# EAGLE board PT08ttl3 (EAGLE 6.6.0)
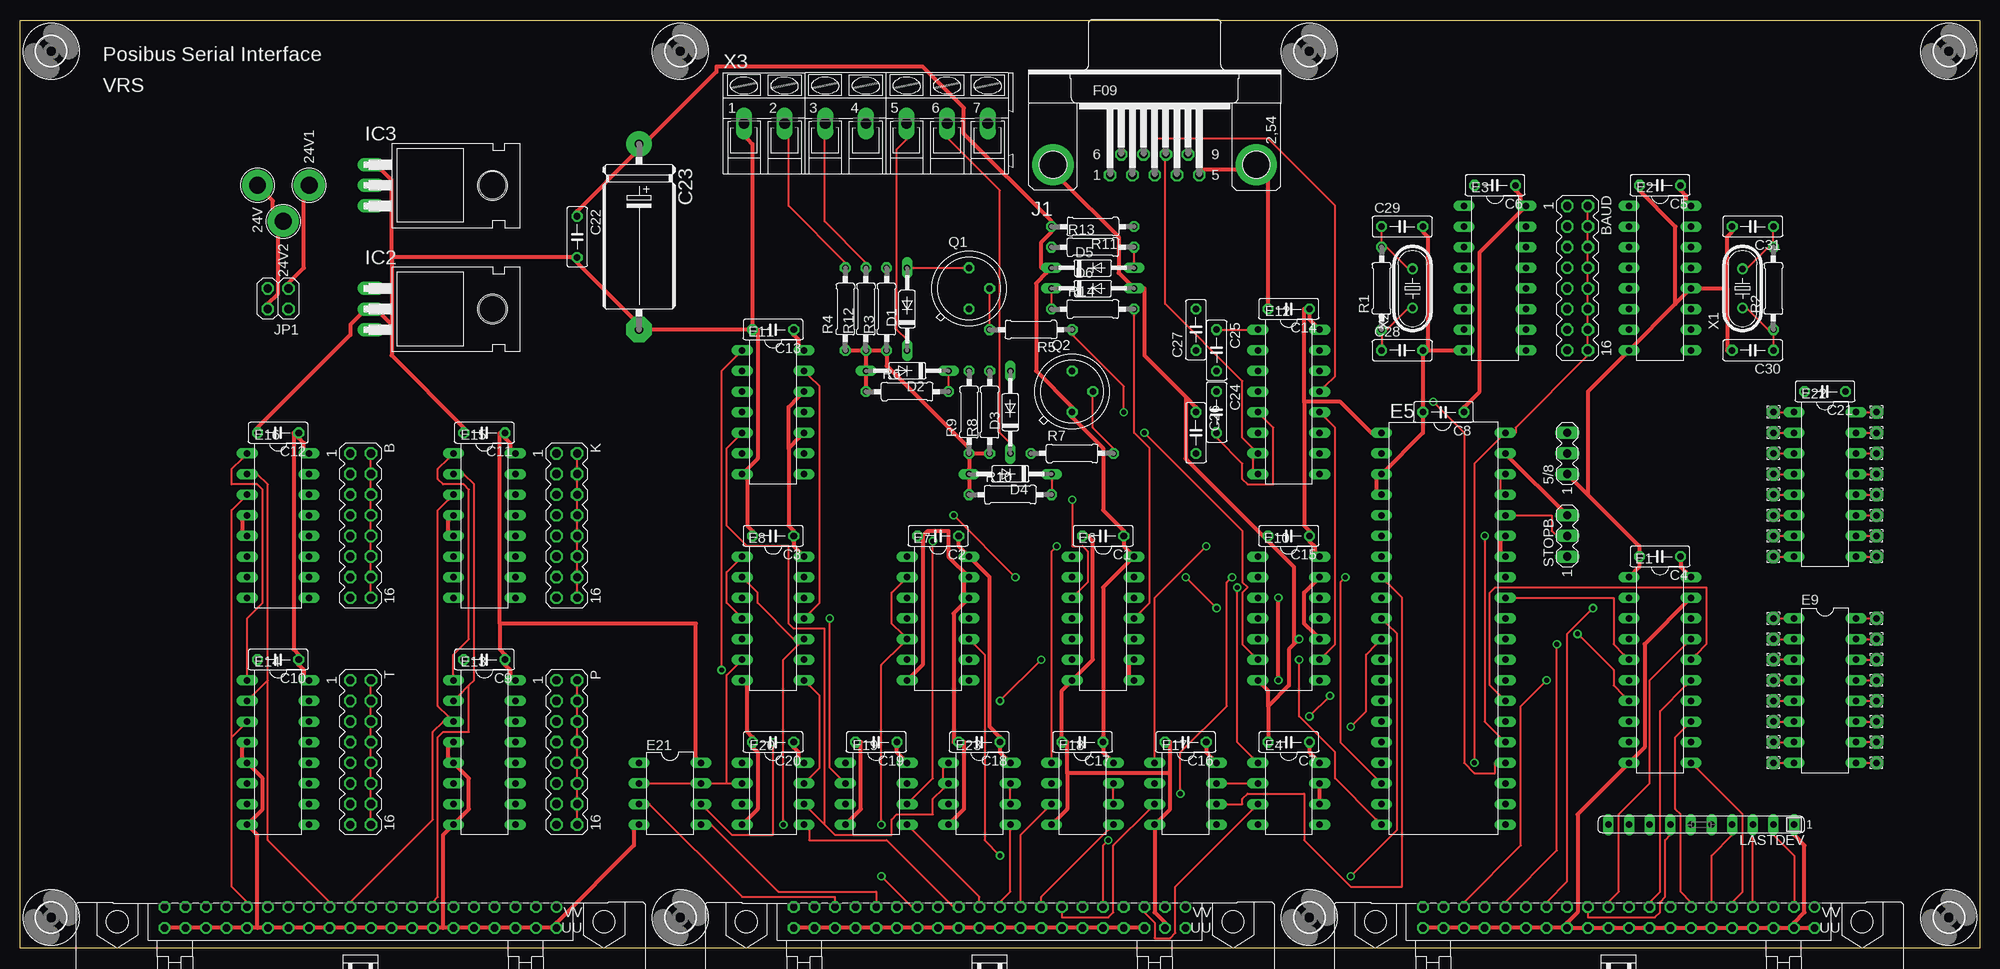
[diagram p2: board, top side]
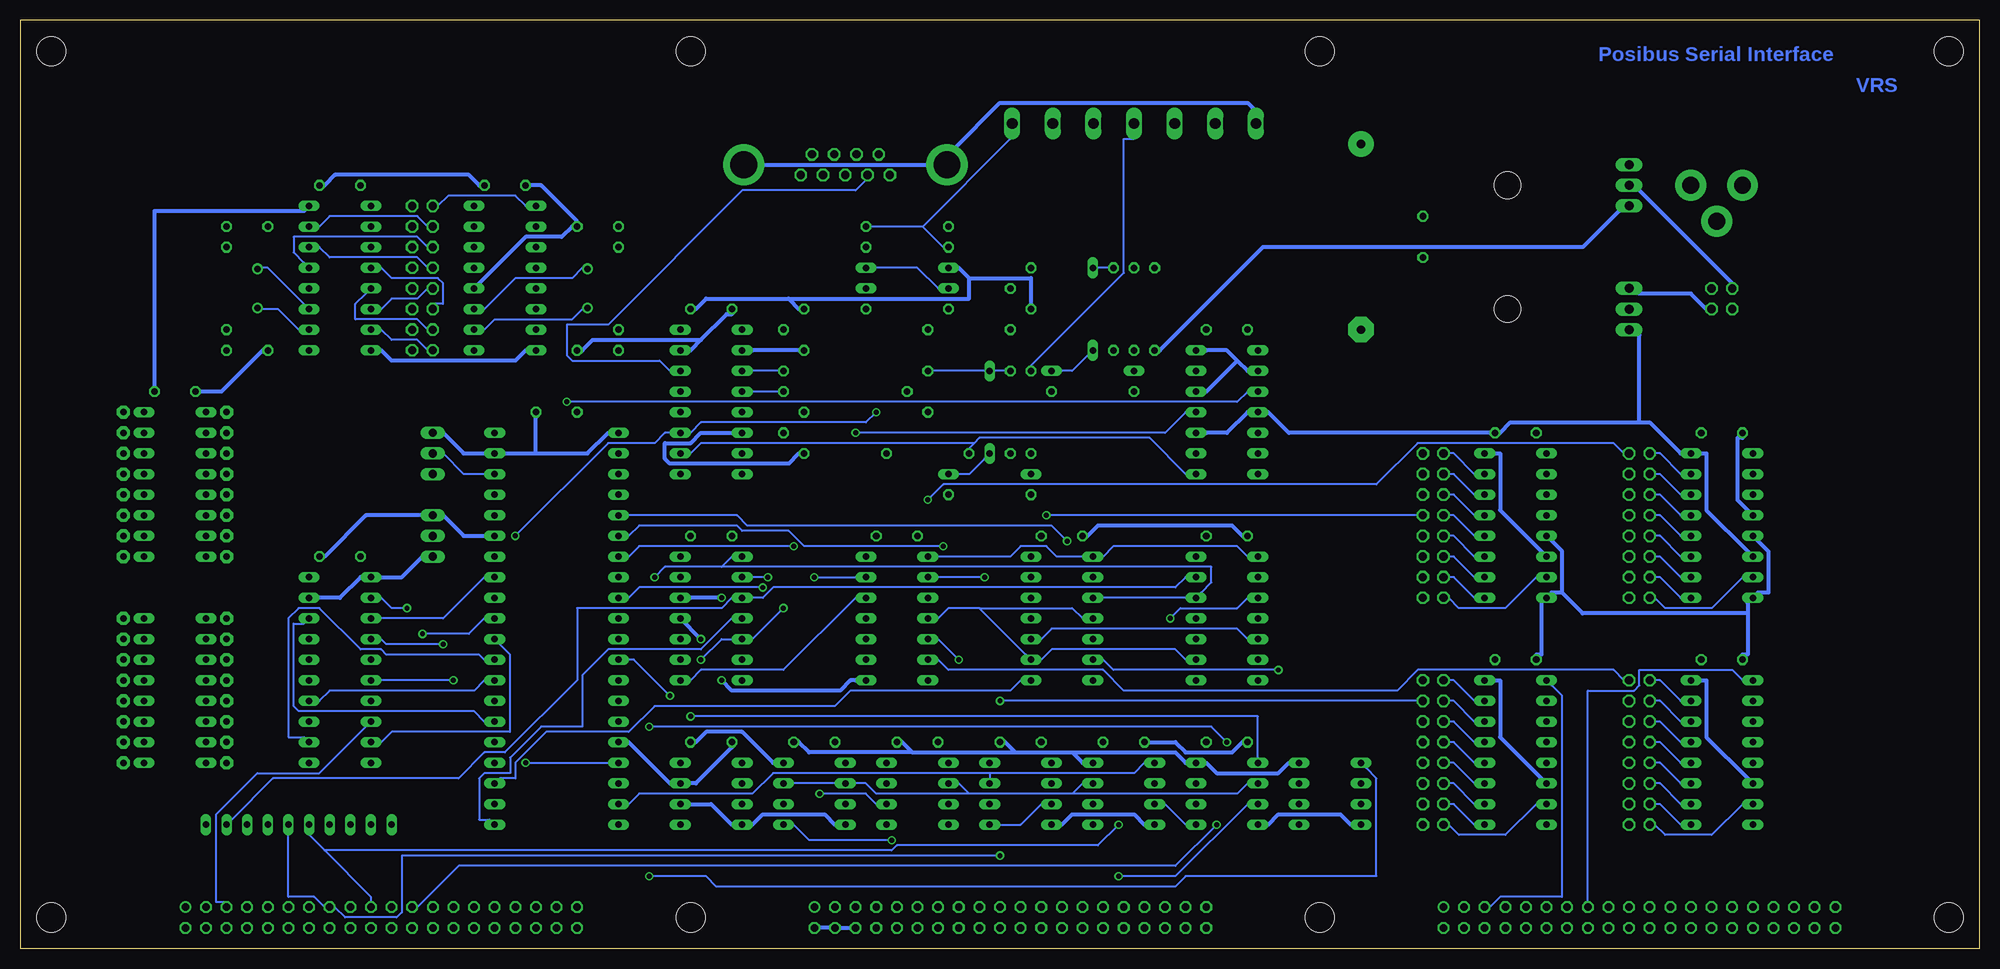
[diagram p3: board, bottom side, seen from below]

Size 241.3 x 114.3 mm. Coordinates in mm from the lower left corner, seen from the top.
Outline: 0,0 0,114.3 241.3,114.3 241.3,0 0,0
Copper layers (1*16): Top 0.035mm / dielectric 1.5mm / Bottom 0.035mm
Design rules "olimex10mil": minimum track width 10mil, minimum drill 24mil, track to track 10mil, track to pad 10mil, pad to pad 10mil, via to via 10mil, smd to smd 10mil, copper to edge 25mil, drill to drill 10mil, minimum pad ring 10mil, minimum via ring 8mil, stop-mask expansion 0mil, vias tented up to drill 0mil, thermal gap 10mil
Net classes: 1 supply: width 0.508 mm

## Footprints (pad centres in the part's own frame; a part is rotated, then mirrored left to right if it is on the bottom)
MA03-1 = drill 1.016 long: 1 -2.54,0; 2 0,0; 3 2.54,0
0820 = drill 2.083 pad 3.81: P$1 0,0
MA08-2 = drill 1.016 octagon: 1 -8.89,-1.27; 2 -8.89,1.27; 3 -6.35,-1.27; 4 -6.35,1.27; 5 -3.81,-1.27; 6 -3.81,1.27; 7 -1.27,-1.27; 8 -1.27,1.27; 9 1.27,-1.27; 10 1.27,1.27; 11 3.81,-1.27; 12 3.81,1.27; 13 6.35,-1.27; 14 6.35,1.27; 15 8.89,-1.27; 16 8.89,1.27
C050-025X075 = drill 0.813 octagon: 1 -2.54,0; 2 2.54,0
E22-9 = drill 1.016 pad 3.15: + -11.43,0 | drill 1.016 pad 3.15 octagon: - 11.43,0
DO35-10 = drill 0.813 long: A 5.08,0; C -5.08,0
DEC40PINH = drill 0.914 octagon: A 24.13,1.27; AA -3.81,1.27; B 24.13,-1.27; BB -3.81,-1.27; C 21.59,1.27; CC -6.35,1.27; D 21.59,-1.27; DD -6.35,-1.27; E 19.05,1.27; EE -8.89,1.27; F 19.05,-1.27; FF -8.89,-1.27; H 16.51,1.27; HH -11.43,1.27; J 16.51,-1.27; JJ -11.43,-1.27; K 13.97,1.27; KK -13.97,1.27; L 13.97,-1.27; LL -13.97,-1.27; M 11.43,1.27; MM -16.51,1.27; N 11.43,-1.27; NN -16.51,-1.27; P 8.89,1.27; PP -19.05,1.27; R 8.89,-1.27; RR -19.05,-1.27; S 6.35,1.27; SS -21.59,1.27; T 6.35,-1.27; TT -21.59,-1.27; U 3.81,1.27; UU -24.13,1.27; V 3.81,-1.27; W 1.27,1.27; X 1.27,-1.27; Y -1.27,1.27; Z -1.27,-1.27 | drill 0.914: VV -24.13,-1.27
DIL20 = drill 0.813 long: 1 -11.43,-3.81; 2 -8.89,-3.81; 3 -6.35,-3.81; 4 -3.81,-3.81; 5 -1.27,-3.81; 6 1.27,-3.81; 7 3.81,-3.81; 8 6.35,-3.81; 9 8.89,-3.81; 10 11.43,-3.81; 11 11.43,3.81; 12 8.89,3.81; 13 6.35,3.81; 14 3.81,3.81; 15 1.27,3.81; 16 -1.27,3.81; 17 -3.81,3.81; 18 -6.35,3.81; 19 -8.89,3.81; 20 -11.43,3.81
DIL16 = drill 0.813 long: 1 -8.89,-3.81; 2 -6.35,-3.81; 3 -3.81,-3.81; 4 -1.27,-3.81; 5 1.27,-3.81; 6 3.81,-3.81; 7 6.35,-3.81; 8 8.89,-3.81; 9 8.89,3.81; 10 6.35,3.81; 11 3.81,3.81; 12 1.27,3.81; 13 -1.27,3.81; 14 -3.81,3.81; 15 -6.35,3.81; 16 -8.89,3.81
DIL08 = drill 0.813 long: 1 -3.81,-3.81; 2 -1.27,-3.81; 3 1.27,-3.81; 4 3.81,-3.81; 5 3.81,3.81; 6 1.27,3.81; 7 -1.27,3.81; 8 -3.81,3.81
DIL40 = drill 0.813 long: 1 -24.13,-7.62; 2 -21.59,-7.62; 3 -19.05,-7.62; 4 -16.51,-7.62; 5 -13.97,-7.62; 6 -11.43,-7.62; 7 -8.89,-7.62; 8 -6.35,-7.62; 9 -3.81,-7.62; 10 -1.27,-7.62; 11 1.27,-7.62; 12 3.81,-7.62; 13 6.35,-7.62; 14 8.89,-7.62; 15 11.43,-7.62; 16 13.97,-7.62; 17 16.51,-7.62; 18 19.05,-7.62; 19 21.59,-7.62; 20 24.13,-7.62; 21 24.13,7.62; 22 21.59,7.62; 23 19.05,7.62; 24 16.51,7.62; 25 13.97,7.62; 26 11.43,7.62; 27 8.89,7.62; 28 6.35,7.62; 29 3.81,7.62; 30 1.27,7.62; 31 -1.27,7.62; 32 -3.81,7.62; 33 -6.35,7.62; 34 -8.89,7.62; 35 -11.43,7.62; 36 -13.97,7.62; 37 -16.51,7.62; 38 -19.05,7.62; 39 -21.59,7.62; 40 -24.13,7.62
DIL14 = drill 0.813 long: 1 -7.62,-3.81; 2 -5.08,-3.81; 3 -2.54,-3.81; 4 0,-3.81; 5 2.54,-3.81; 6 5.08,-3.81; 7 7.62,-3.81; 8 7.62,3.81; 9 5.08,3.81; 10 2.54,3.81; 11 0,3.81; 12 -2.54,3.81; 13 -5.08,3.81; 14 -7.62,3.81
TO220H = drill 1.118 long: 1 -2.54,-10.16; 2 0,-10.16; 3 2.54,-10.16 | hole 3.302: 0,4.826
F09HP = drill 1.016 octagon: 1 -5.486,-1.27; 2 -2.743,-1.27; 3 0,-1.27; 4 2.743,-1.27; 5 5.486,-1.27; 6 -4.115,1.27; 7 -1.372,1.27; 8 1.372,1.27; 9 4.115,1.27 | drill 3.302 pad 5.08: G1 -12.522,0; G2 12.522,0
2X02 = drill 1.016 octagon: 1 -1.27,-1.27; 2 -1.27,1.27; 3 1.27,-1.27; 4 1.27,1.27
SIL10 = drill 0.813 long: 1 -11.43,0; 2 -8.89,0; 3 -6.35,0; 4 -3.81,0; 5 -1.27,0; 6 1.27,0; 7 3.81,0; 8 6.35,0; 9 8.89,0; 10 11.43,0
1,6/0,8 = drill 0.813 pad 1.6 octagon: 1 0,0
TO39 = drill 0.813 octagon: 1 0,-2.54; 2 2.54,0; 3 0,2.54
0207/10 = drill 0.813 octagon: 1 -5.08,0; 2 5.08,0
3,6 = hole 3.6: 0,0
HC49U-V = drill 0.813: 1 -2.413,0; 2 2.413,0
AK300/7 = drill 1.321 long: 1 -15.011,0; 2 -10.008,0; 3 -5.004,0; 4 0,0; 5 5.004,0; 6 10.008,0; 7 15.011,0

## Placement (x,y rotation side)
5/8  [MA03-1]  190.5,60.96 90 top
24V  PAD-0820  [0820]  29.21,93.98 270 top
24V1  PAD-0820  [0820]  35.56,93.98 90 top
24V2  PAD-0820  [0820]  32.38,89.53 270 top
B  [MA08-2]  41.91,52.07 270 top
BAUD  [MA08-2]  191.77,82.55 270 top
C1  0.1  [C050-025X075]  133.35,50.8 180 top
C2  0.1  [C050-025X075]  113.03,50.8 180 top
C3  0.1  [C050-025X075]  92.71,50.8 180 top
C4  0.1  [C050-025X075]  201.93,48.26 180 top
C5  0.1  [C050-025X075]  201.93,93.98 180 top
C6  0.1  [C050-025X075]  181.61,93.98 180 top
C7  0.1  [C050-025X075]  156.21,25.4 180 top
C8  0.1  [C050-025X075]  175.26,66.04 180 top
C9  0.1  [C050-025X075]  57.15,35.56 180 top
C10  0.1  [C050-025X075]  31.75,35.56 180 top
C11  0.1  [C050-025X075]  57.15,63.5 180 top
C12  0.1  [C050-025X075]  31.75,63.5 180 top
C13  0.1  [C050-025X075]  92.71,76.2 180 top
C14  0.1  [C050-025X075]  156.21,78.74 180 top
C15  0.1  [C050-025X075]  156.21,50.8 180 top
C16  0.1  [C050-025X075]  143.51,25.4 180 top
C17  0.1  [C050-025X075]  130.81,25.4 180 top
C18  0.1  [C050-025X075]  118.11,25.4 180 top
C19  0.1  [C050-025X075]  105.41,25.4 180 top
C20  0.1  [C050-025X075]  92.71,25.4 180 top
C21  0.1  [C050-025X075]  222.25,68.58 180 top
C22  0.1  [C050-025X075]  68.58,87.63 270 top
C23  100uf  [E22-9]  76.2,87.63 270 top
C24  0.1  [C050-025X075]  147.32,66.04 270 top
C25  0.1  [C050-025X075]  147.32,73.66 270 top
C26  0.1  [C050-025X075]  144.78,63.5 270 top
C27  0.1  [C050-025X075]  144.78,76.2 90 top
C28  22pf  [C050-025X075]  170.18,73.66 0 top
C29  22pf  [C050-025X075]  170.18,88.9 0 top
C30  22pf  [C050-025X075]  213.36,73.66 180 top
C31  22pf  [C050-025X075]  213.36,88.9 180 top
D1  D664  [DO35-10]  109.22,78.74 90 top
D2  D664  [DO35-10]  109.22,71.12 180 top
D3  D664  [DO35-10]  121.92,66.04 90 top
D4  D664  [DO35-10]  121.92,58.42 180 top
D5  D664  [DO35-10]  132.08,83.82 0 top
D6  D664  [DO35-10]  132.08,81.28 0 top
D34L  [DEC40PINH]  119.38,3.81 180 top
D35L  [DEC40PINH]  41.91,3.81 180 top
D36L  [DEC40PINH]  196.85,3.81 180 top
E1  74LS240N  [DIL20]  201.93,34.29 270 top
E2  74HCT4060N  [DIL16]  201.93,82.55 270 top
E3  74HCT4060N  [DIL16]  181.61,82.55 270 top
E4  DS75452N  [DIL08]  156.21,19.05 270 top
E5  HD6402  [DIL40]  175.26,39.37 270 top
E6  74LS02N  [DIL14]  133.35,40.64 270 top
E7  74LS00N  [DIL14]  113.03,40.64 270 top
E8  74LS08N  [DIL14]  92.71,40.64 270 top
E9  SPARE  [DIL16]  222.25,31.75 270 top
E10  74LS04N  [DIL14]  156.21,40.64 270 top
E11  74LS74N  [DIL14]  92.71,66.04 270 top
E12  MAX232  [DIL16]  156.21,67.31 270 top
E13  74LS138N  [DIL16]  57.15,24.13 270 top
E14  74LS138N  [DIL16]  31.75,24.13 270 top
E15  74LS138N  [DIL16]  57.15,52.07 270 top
E16  74LS138N  [DIL16]  31.75,52.07 270 top
E17  DS75452N  [DIL08]  143.51,19.05 270 top
E18  DS75452N  [DIL08]  130.81,19.05 270 top
E19  DS75452N  [DIL08]  105.41,19.05 270 top
E20  DS75452N  [DIL08]  92.71,19.05 270 top
E21  DS75452N  [DIL08]  80.01,19.05 270 top
E22  SPARE  [DIL16]  222.25,57.15 270 top
E23  DS75452N  [DIL08]  118.11,19.05 270 top
IC2  7805T  [TO220H]  53.34,78.74 270 top
IC3  7915T  [TO220H]  53.34,93.98 270 top
J1  [F09HP]  139.7,96.52 0 top
JP1  [2X02]  31.75,80.01 180 top
K  [MA08-2]  67.31,52.07 270 top
LASTDEV  100  [SIL10]  207.01,15.24 180 top
P  [MA08-2]  67.31,24.13 270 top
PAD1  [1,6/0,8]  215.9,40.64 270 top
PAD2  [1,6/0,8]  215.9,38.1 270 top
PAD3  [1,6/0,8]  215.9,35.56 270 top
PAD4  [1,6/0,8]  215.9,33.02 270 top
PAD5  [1,6/0,8]  215.9,30.48 270 top
PAD6  [1,6/0,8]  215.9,27.94 270 top
PAD7  [1,6/0,8]  215.9,25.4 270 top
PAD8  [1,6/0,8]  215.9,22.86 270 top
PAD9  [1,6/0,8]  228.6,40.64 270 top
PAD18  [1,6/0,8]  215.9,66.04 270 top
PAD19  [1,6/0,8]  215.9,63.5 270 top
PAD28  [1,6/0,8]  215.9,60.96 270 top
PAD29  [1,6/0,8]  215.9,58.42 270 top
PAD30  [1,6/0,8]  215.9,55.88 270 top
PAD31  [1,6/0,8]  215.9,53.34 270 top
PAD32  [1,6/0,8]  215.9,50.8 270 top
PAD33  [1,6/0,8]  215.9,48.26 270 top
PAD34  [1,6/0,8]  228.6,66.04 270 top
PAD35  [1,6/0,8]  228.6,63.5 270 top
PAD36  [1,6/0,8]  228.6,60.96 270 top
PAD37  [1,6/0,8]  228.6,58.42 270 top
PAD38  [1,6/0,8]  228.6,55.88 270 top
PAD39  [1,6/0,8]  228.6,53.34 270 top
PAD40  [1,6/0,8]  228.6,50.8 270 top
PAD41  [1,6/0,8]  228.6,48.26 270 top
PAD42  [1,6/0,8]  228.6,38.1 270 top
PAD43  [1,6/0,8]  228.6,35.56 270 top
PAD44  [1,6/0,8]  228.6,33.02 270 top
PAD45  [1,6/0,8]  228.6,30.48 270 top
PAD46  [1,6/0,8]  228.6,27.94 270 top
PAD47  [1,6/0,8]  228.6,25.4 270 top
PAD48  [1,6/0,8]  228.6,22.86 270 top
Q1  2N2904  [TO39]  116.84,81.28 0 top
Q2  2N2904  [TO39]  129.54,68.58 0 top
R1  10M  [0207/10]  167.64,81.28 90 top
R2  10M  [0207/10]  215.9,81.28 90 top
R3  1.5K 1/2W  [0207/10]  106.68,78.74 90 top
R4  750 1W  [0207/10]  101.6,78.74 90 top
R5  470  [0207/10]  124.46,76.2 180 top
R6  15K 1/2W  [0207/10]  109.22,68.58 0 top
R7  470  [0207/10]  129.54,60.96 0 top
R8  1.5K 1/2W  [0207/10]  119.38,66.04 90 top
R9  750 1W  [0207/10]  116.84,66.04 90 top
R10  15K 1/2W  [0207/10]  121.92,55.88 0 top
R11  750 1/2W  [0207/10]  132.08,88.9 180 top
R12  560 1/2W  [0207/10]  104.14,78.74 90 top
R13  82  [0207/10]  132.08,86.36 0 top
R14  3.3K  [0207/10]  132.08,78.74 0 top
STOPB  [MA03-1]  190.5,50.8 90 top
T  [MA08-2]  41.91,24.13 270 top
U$1  [3,6]  237.49,3.81 0 top
U$2  [3,6]  237.49,110.49 0 top
U$3  [3,6]  3.81,110.49 0 top
U$4  [3,6]  3.81,3.81 0 top
U$5  [3,6]  158.75,110.49 0 top
U$6  [3,6]  81.28,3.81 0 top
U$7  [3,6]  158.75,3.81 0 top
U$8  [3,6]  81.28,110.49 0 top
X1  2.4576Mhz  [HC49U-V]  212.09,81.28 90 top
X2  3.579545Mhz  [HC49U-V]  171.45,81.28 90 top
X3  [AK300/7]  104.14,101.6 0 top

## Tracks (layer width: path | path; a pad name or v marks a point on that pad's centre or on a via)
24V1
  Top 0.508: JP1.1 33.02,81.92 34.92,83.82 34.92,92.71 24V1.P$1
24V2
  Top 0.508: JP1.4 30.48,79.38 31.75,80.64 31.75,88.27 24V2.P$1 31.11,90.81 31.11,92.08 30.48,92.71 24V.P$1
!ACB04
  Top 0.254: E19.5 109.86,14.61 118.11,6.35 118.11,5.71 D34L.X
!ACB05
  Top 0.254: E18.3 126.36,17.14 123.19,13.97 123.19,5.71 D34L.BB
!ACB06
  Top 0.254: E17.3 139.06,17.14 134.62,12.7 134.62,4.45 133.99,3.81 128.27,3.81 128.27,4.45 D34L.FF
!ACB07  (via drill 0.61)
  Top 0.254: v133.99,13.34 133.35,12.7 133.35,5.71 D34L.LL
  Bottom 0.254: v133.99,13.34 144.15,13.34 146.05,15.24 E17.5
!ACB08
  Top 0.254: E4.3 151.76,17.14 142.24,7.62 142.24,1.91 141.6,1.27 139.7,1.27 139.7,3.17 138.43,4.45 D34L.RR
!ACB09
  Top 0.254: E21.3 77.47,17.78 88.9,6.35 100.33,6.35 100.33,5.71 D34L.F
!ACB10
  Top 0.254: E21.5 85.09,15.24 93.34,6.99 105.41,6.99 105.41,5.71 D34L.L
!ACB11  (via drill 0.61)
  Top 0.254: v106.05,8.89 109.86,5.08 D34L.R
  Bottom 0.254: v106.05,8.89 99.06,8.89 90.17,17.78 E20.3
!ACCLEAR
  Top 0.254: E18.5 133.99,14.61 125.73,6.35 125.73,5.71 D34L.DD
!B  (via drill 0.61)
  Top 0.254: B.16 43.18,43.81 43.18,45.09 B.14 43.18,46.35 43.18,47.62 B.12 43.18,48.9 43.18,50.16 B.10 43.18,51.44 43.18,52.7 B.8 43.18,53.98 43.18,55.24 B.6 43.18,56.52 43.18,57.78 B.4 43.18,59.05 43.18,60.33 B.2 | v129.54,55.24 129.54,49.53 130.81,49.53 131.44,48.9 131.44,45.09 130.18,43.81 E6.3
  Bottom 0.254: v129.54,55.24 127.64,57.15 74.3,57.15 69.22,62.23 45.09,62.23 43.81,60.96 B.2
!BINIT
  Top 0.254: LASTDEV.2 215.9,13.97 218.44,11.43 218.44,5.71 D36L.TT
  Bottom 0.254: E8.13 97.79,45.72 99.06,44.45 148.59,44.45 149.86,43.18 151.13,43.18 E10.3 153.67,43.18 154.94,41.91 172.72,41.91 172.72,33.02 181.61,24.13 184.15,24.13 187.32,20.95 210.19,20.95 215.26,15.88 LASTDEV.2
!INT_RQ
  Top 0.254: D34L.Z 120.65,5.71 121.92,6.99 121.92,14.61 E23.5
  Bottom 0.254: E23.3 115.57,17.78 118.11,15.24 120.65,15.24 E23.5
!IOS
  Top 0.254: D34L.V 114.94,5.08 106.68,13.34 97.16,13.34 97.16,14.61 E20.5
  Bottom 0.254: E20.5 97.79,15.24 100.33,17.78 E19.3
!K  (via drill 0.61)
  Top 0.254: K.16 68.58,43.81 68.58,45.09 K.14 68.58,46.35 68.58,47.62 K.12 68.58,48.9 68.58,50.16 K.10 68.58,51.44 68.58,52.7 K.8 68.58,53.98 68.58,55.24 K.6 68.58,56.52 68.58,57.78 K.4 68.58,59.05 68.58,60.33 K.2 | v114.94,53.34 v122.56,45.72
  Bottom 0.254: v122.56,45.72 128.27,45.72 E6.2 | v114.94,53.34 69.22,53.34 K.8
!KCC  (via drill 0.61)
  Top 0.254: v163.19,45.72 162.56,45.09 162.56,25.4 167,20.95 E5.18
  Bottom 0.254: E7.3 107.95,43.18 97.79,43.18 E8.12 95.89,43.81 94.61,45.09 94.61,46.99 154.94,46.99 | v163.19,45.72 161.93,46.99 154.94,46.99 | 154.94,46.99 153.67,48.26 E10.1
!P  (via drill 0.61)
  Top 0.254: P.16 68.58,15.88 68.58,17.14 P.14 68.58,18.41 68.58,19.68 P.12 68.58,20.95 68.58,22.23 P.10 68.58,23.5 68.58,24.77 P.8 68.58,26.04 68.58,27.3 P.6 68.58,28.57 68.58,29.84 P.4 68.58,31.11 68.58,32.38 P.2 | v120.65,30.48 v125.73,35.56
  Bottom 0.254: v125.73,35.56 128.27,38.1 E6.5 | v120.65,30.48 69.22,30.48 P.4
!RXL
  Top 0.254: E6.11 137.79,41.27 139.06,42.55 139.06,61.59 137.16,63.5 137.16,78.11 R14.2
!T
  Top 0.254: T.16 43.18,15.88 43.18,17.14 T.14 43.18,18.41 43.18,19.68 T.12 43.18,20.95 43.18,22.23 T.10 43.18,23.5 43.18,24.77 T.8 43.18,26.04 43.18,27.3 T.6 43.18,28.57 43.18,29.84 T.4 43.18,31.11 43.18,32.38 T.2
  Bottom 0.254: E6.6 128.27,35.56 127,34.29 107.95,34.29 105.41,31.75 71.75,31.75 69.22,34.29 45.09,34.29 43.81,33.02 T.2
!TCF  (via drill 0.61)
  Top 0.254: v86.36,34.29 86.36,71.12 88.27,73.03 E11.1
  Bottom 0.254: v86.36,34.29 106.68,34.29 107.95,35.56 E7.6
!TPC
  Bottom 0.254: E7.8 118.11,33.02 119.38,31.75 139.06,31.75 140.97,29.84 163.19,29.84 166.37,26.67 176.53,26.67 180.34,22.86 180.34,20.95 182.25,20.95 E5.23
+24V
  Bottom 0.508: JP1.2 33.66,78.74 35.56,80.64 41.91,80.64 IC2.1
-15V
  Top 0.508: R10.1 116.84,56.52 116.84,57.78 D4.A 116.84,59.05 116.84,60.33 R9.1 | R8.1 118.75,60.96 117.47,60.96 R9.1 | R6.1 104.14,69.22 104.14,70.48 D2.A 104.14,71.75 104.14,73.03 R12.1 | R4.1 102.23,73.66 103.5,73.66 R12.1 | R12.1 104.78,73.66 106.05,73.66 R3.1 106.68,73.03 106.68,71.75 116.84,61.59 R9.1
  Bottom 0.508: IC3.3 44.45,90.81 48.9,86.36 88.27,86.36 100.97,73.66 R4.1
-24V
  Bottom 0.508: JP1.3 30.48,81.92 41.91,93.34 IC3.2
B110
  Bottom 0.254: E3.1 179.07,91.44 180.34,92.71 188.59,92.71 189.87,91.44 BAUD.1
B150
  Bottom 0.254: E2.15 204.47,88.9 203.2,90.17 192.41,90.17 191.13,88.9 BAUD.3
B300
  Bottom 0.254: E2.13 206.38,84.45 207.65,85.72 207.65,87.63 192.41,87.63 191.13,86.36 BAUD.5
B600
  Bottom 0.254: E2.14 204.47,86.36 203.2,85.09 192.41,85.09 191.13,83.82 BAUD.7
B1200
  Bottom 0.254: E2.6 196.85,78.74 195.58,80.01 192.41,80.01 191.13,81.28 BAUD.9
B2400
  Bottom 0.254: E2.4 196.85,83.82 195.58,82.55 189.87,82.55 189.23,81.92 189.23,79.38 190.5,79.38 BAUD.11
B4800
  Bottom 0.254: E2.5 198.75,80.64 200.03,79.38 200.03,77.47 192.41,77.47 191.13,76.2 BAUD.13
B9600
  Bottom 0.254: E2.7 196.85,76.2 195.58,74.93 192.41,74.93 191.13,73.66 BAUD.15
BAC04
  Top 0.254: E1.17 205.1,37.47 200.66,33.02 200.66,20.32 196.85,16.51 196.85,6.99 195.58,5.71 D36L.X
BAC05
  Top 0.254: E1.15 205.1,32.38 201.93,29.21 201.93,6.99 200.66,5.71 D36L.BB
BAC06
  Top 0.254: E1.13 205.1,27.3 203.84,26.04 203.84,17.14 204.47,16.51 204.47,6.99 205.74,5.71 D36L.FF
BAC07
  Top 0.254: E1.11 206.38,22.23 212.09,16.51 212.09,6.99 210.82,5.71 D36L.LL
BAC08
  Bottom 0.254: E1.8 198.75,27.3 204.47,21.59 212.09,21.59 217.17,16.51 217.17,5.71 215.9,5.71 D36L.RR
BAC09  (via drill 0.61)
  Top 0.254: v187.96,33.02 184.78,29.84 184.78,12.7 177.8,5.71 D36L.F
  Bottom 0.254: v187.96,33.02 196.85,33.02 E1.6
BAC10  (via drill 0.61)
  Top 0.254: v189.23,37.47 189.23,12.06 182.88,5.71 D36L.L
  Bottom 0.254: v189.23,37.47 196.22,37.47 196.85,38.1 E1.4
BAC11  (via drill 0.61)
  Top 0.254: v193.68,41.91 190.5,38.73 190.5,8.26 187.96,5.71 D36L.R
  Bottom 0.254: v193.68,41.91 195.58,41.91 196.85,43.18 E1.2
BCLK  (via drill 0.61)
  Top 0.254: BAUD.2 193.04,90.81 193.04,89.53 BAUD.4 193.04,88.27 193.04,87 BAUD.6 193.04,85.72 193.04,84.45 BAUD.8 193.04,83.19 193.04,81.92 BAUD.10 193.04,80.64 193.04,79.38 BAUD.12 193.04,78.11 193.04,76.83 BAUD.14 193.04,75.56 193.04,74.3 BAUD.16 193.04,73.03 184.15,64.14 184.15,63.5 E5.40 182.25,62.87 179.07,59.69 v179.07,22.86
  Bottom 0.254: v179.07,22.86 168.91,22.86 E5.17
BIOP1  (via drill 0.61)
  Top 0.254: E8.2 89.53,45.09 90.81,43.81 90.81,42.55 95.25,38.1 E8.10 95.89,37.47 93.98,35.56 v93.98,15.24 | LASTDEV.7 203.2,13.97 202.56,13.34 202.56,6.35 201.93,5.71 201.93,4.45 201.29,3.81 193.04,3.81 193.04,4.45 D36L.V
  Bottom 0.254: v93.98,15.24 99.06,10.16 187.32,10.16 192.41,5.08 D36L.V
BIOP2  (via drill 0.61)
  Top 0.254: E7.2 108.58,45.09 107.31,43.81 107.31,40.01 108.58,38.73 E7.5 108.58,37.47 106.05,34.92 v106.05,15.24
  Bottom 0.254: 203.84,12.06 198.12,6.35 198.12,5.71 D36L.Z | 203.84,12.06 205.74,13.97 LASTDEV.6 | v106.05,15.24 108.58,12.7 133.35,12.7 133.99,12.06 203.84,12.06
BIOP4  (via drill 0.61)
  Top 0.254: v120.65,11.43 118.75,13.34 118.75,36.2 117.47,37.47 E7.10
  Bottom 0.254: LASTDEV.5 208.28,13.97 208.28,6.35 205.1,6.35 203.84,5.08 D36L.DD 202.56,5.08 201.29,3.81 194.94,3.81 194.31,4.45 194.31,11.43 v120.65,11.43 | E8.5 90.17,38.1 91.44,39.37 114.3,39.37 115.57,38.1 E7.10
BMB03
  Top 0.254: E15.3 52.7,55.24 51.44,53.98 51.44,29.84 52.7,28.57 E13.3 52.07,27.94 50.8,26.67 50.8,15.88 40.64,5.71 D35L.X
BMB04
  Top 0.254: 55.24,32.38 55.88,33.02 55.88,57.15 54.61,58.42 E15.2 | 55.24,32.38 53.98,31.11 E13.2 | 55.24,32.38 55.24,26.67 52.07,26.67 51.44,26.04 51.44,6.35 50.8,5.71 D35L.FF
BMB05
  Top 0.254: E15.1 52.7,60.33 51.44,59.05 51.44,57.78 52.07,57.15 54.61,57.15 55.24,56.52 55.24,38.1 53.34,36.2 53.34,33.66 E13.1
  Bottom 0.254: E13.1 52.7,32.38 51.44,31.11 51.44,6.35 59.05,6.35 60.33,5.08 D35L.RR
BMB06
  Top 0.254: 26.04,26.04 27.3,27.3 E14.3 | 26.04,26.04 26.04,7.62 27.94,5.71 D35L.L | 26.04,26.04 26.04,53.98 27.3,55.24 E16.3
BMB07
  Top 0.254: 30.48,33.02 28.57,31.11 E14.2 | 30.48,33.02 30.48,57.15 29.21,58.42 E16.2 | 30.48,33.02 30.48,13.34 38.1,5.71 D35L.V
BMB08
  Top 0.254: E14.1 27.94,33.66 27.94,40.64 29.84,42.55 29.84,56.52 29.21,57.15 26.04,57.15 26.04,59.05 27.3,60.33 E16.1
  Bottom 0.254: D35L.DD 48.26,5.71 48.26,31.75 42.55,31.75 41.91,32.38 41.91,34.29 30.48,34.29 29.21,33.02 E14.1
BTS1
  Top 0.254: LASTDEV.3 213.36,13.97 213.36,5.71 D36L.NN
BTS3
  Top 0.254: LASTDEV.4 210.82,13.97 208.28,11.43 208.28,5.71 D36L.JJ
CS8
  Top 0.254: E5.37 182.25,56.52 182.25,57.78 E5.38
  Bottom 0.254: 5/8.2 189.23,60.96 186.69,58.42 184.15,58.42 E5.38
GND  (via drill 0.61)
  Top 0.508: C3.2 90.17,51.44 89.53,52.07 89.53,57.78 E11.7 90.81,60.33 90.81,76.2 C13.2 | C13.2 C23.- 75.56,77.47 68.58,84.45 C22.2 45.72,85.09 | C13.2 90.17,99.06 89.53,99.69 X3.1 | E15.5 52.7,51.44 52.7,52.7 E15.4 | E16.5 27.3,51.44 27.3,52.7 E16.4 | E13.4 52.7,24.77 52.7,23.5 E13.5 55.24,20.95 55.24,17.14 E13.8 52.07,13.97 52.07,2.54 | E14.4 27.3,24.77 27.3,23.5 E14.5 29.84,20.95 29.84,17.14 E14.8 29.21,13.97 29.21,2.54 | D35L.A D35L.C D35L.E D35L.H D35L.K 29.21,2.54 | 29.21,2.54 D35L.M D35L.P D35L.S D35L.U D35L.W D35L.Y D35L.AA D35L.CC D35L.EE 52.07,2.54 | 52.07,2.54 D35L.HH D35L.KK D35L.MM D35L.PP D35L.SS D35L.UU 66.04,3.17 75.56,12.7 75.56,14.61 E21.4 | E8.7 89.53,32.38 89.53,26.67 90.17,26.04 C20.2 90.17,24.77 90.81,24.13 90.81,17.14 E20.4 | E7.7 111.12,34.92 111.12,50.8 | E19.4 103.5,17.14 103.5,25.4 C19.2 | E23.4 116.2,17.14 116.2,25.4 C18.2 114.94,25.4 114.94,41.27 E7.12 116.2,43.81 116.2,45.09 E7.13 114.3,48.26 114.3,51.44 111.76,51.44 111.12,50.8 | C2.2 111.12,50.8 | LASTDEV.1 218.44,13.97 219.71,12.7 219.71,4.45 218.44,3.17 D36L.SS | D36L.SS D36L.UU | D36L.A D36L.C D36L.E D36L.H D36L.K D36L.M D36L.P D36L.S | D36L.S D36L.U D36L.W D36L.Y D36L.AA D36L.CC D36L.EE D36L.HH D36L.KK D36L.MM D36L.PP D36L.SS | 203.84,79.38 E2.12 210.19,81.28 | 203.84,79.38 E2.8 193.04,68.58 193.04,55.88 | 203.84,79.38 203.84,88.9 199.39,93.34 C5.2 | 210.19,81.28 210.19,73.66 C30.2 | 210.19,81.28 210.19,87.63 210.82,88.27 C31.2 | E1.1 199.39,46.99 C4.2 199.39,49.53 193.04,55.88 | 193.04,55.88 5/8.1 | E1.19 200.03,37.47 200.03,24.77 E1.10 191.77,16.51 191.77,4.45 190.5,3.17 D36L.S
  Top 0.508: E5.4 167,56.52 167,57.78 E5.3 172.72,63.5 C8.2 C28.2 173.35,73.66 | 173.35,73.66 E3.8 | 173.35,73.66 173.35,87.63 172.72,88.27 C29.2 | J1.5 145.41,95.89 149.86,95.89 J1.G2 153.67,94.61 C14.2 | D34L.A D34L.C D34L.E D34L.H D34L.K D34L.M D34L.P D34L.S D34L.U D34L.W D34L.Y D34L.AA D34L.CC D34L.EE D34L.HH D34L.KK D34L.MM D34L.PP | 143.51,67.94 138.43,73.03 138.43,81.28 D6.A 135.25,83.19 135.25,87.63 128.27,94.61 J1.G1 | 143.51,67.94 144.78,66.67 C26.1 | 143.51,67.94 143.51,60.33 153.03,50.8 C15.2 153.67,50.16 156.84,46.99 156.84,37.47 | 153.67,29.84 C7.2 | 153.67,29.84 153.67,31.75 E10.7 | 156.84,37.47 156.21,36.83 156.21,32.38 153.67,29.84 | 156.84,37.47 v157.48,38.1 | E4.6 E4.7 | 141.6,21.59 141.6,25.4 C16.2 | 141.6,21.59 141.6,17.14 E17.4 139.7,4.45 140.97,3.17 D34L.SS | E18.4 128.91,17.14 128.91,21.59 | 128.91,21.59 128.91,25.4 C17.2 128.27,31.75 E6.7 132.08,35.56 132.08,50.16 131.44,50.8 C1.2 | 141.6,21.59 128.91,21.59 | 45.72,76.83 45.72,73.03 54.61,64.14 C11.2 | 45.72,76.83 44.45,78.11 IC2.2 41.91,78.11 40.64,76.83 40.64,75.56 29.21,64.14 C12.2 | 45.72,85.09 45.72,76.83 | 45.72,85.09 45.72,94.61 44.45,95.89 IC3.1
  Bottom 0.508: C9.2 54.61,36.2 53.98,36.2 53.98,42.55 E15.8 52.7,43.81 51.44,43.81 | E15.5 51.44,48.9 51.44,43.81 | 28.57,41.27 28.57,36.2 29.21,36.2 C10.2 | 28.57,41.27 28.57,42.55 E16.8 27.3,43.81 26.04,43.81 26.04,48.9 E16.5 | E16.4 29.84,55.24 29.84,62.87 29.21,62.87 C12.2 | 51.44,43.81 48.9,41.27 28.57,41.27 | E21.4 77.47,15.24 78.74,16.51 86.36,16.51 87.63,15.24 E20.4 | E19.4 102.87,15.24 104.14,16.51 111.76,16.51 113.03,15.24 E23.4 | C19.2 99.06,25.4 97.79,24.13 92.08,24.13 90.81,25.4 C20.2 | C3.2 90.81,50.8 92.08,52.07 108.58,52.07 109.86,50.8 C2.2 | C21.2 216.53,68.58 211.46,73.66 C30.2 | STOPB.1 191.77,48.26 194.31,45.72 E1.1 199.39,45.72 201.93,43.18 E1.19 | C6.2 177.16,93.98 172.72,89.53 C29.2 173.35,88.9 174.62,87.63 179.07,87.63 E3.12 | 157.48,74.93 154.31,78.11 153.67,78.11 C14.2 | 157.48,74.93 158.75,73.66 E12.15 | J1.G2 J1.G1 126.36,98.42 120.65,104.14 90.17,104.14 89.53,103.5 X3.1 | 157.48,74.93 170.81,74.93 172.09,73.66 C28.2 | D34L.PP D34L.SS D34L.UU | v157.48,38.1 E10.11 | E4.6 156.21,17.78 153.67,15.24 E4.4 151.13,15.24 149.86,16.51 142.24,16.51 140.97,15.24 E17.4 | E5.16 166.37,25.4 161.29,20.32 E4.7 158.12,20.32 153.67,24.77 C7.2 | E2.8 196.85,73.66 195.58,72.39 180.34,72.39 179.07,73.66 E3.8
KB
  Top 0.254: E8.4 88.27,41.27 87,42.55 87,46.35 88.27,47.62 E8.1
  Bottom 0.254: E8.1 90.17,48.26 91.44,49.53 106.68,49.53 107.95,48.26 E7.1 110.49,48.26 113.67,48.26 114.94,49.53 118.11,49.53 119.38,48.26 128.27,48.26 E6.1
KBF
  Top 0.254: E23.6 E23.7
  Bottom 0.254: 121.92,21.59 104.14,21.59 102.87,22.86 E19.1 | 121.92,21.59 E23.7 | 121.92,21.59 148.59,21.59 151.13,19.05 165.1,19.05 166.37,17.78 E5.19
KCC  (via drill 0.61)
  Top 0.254: E18.6 E18.7 | v149.22,45.72 148.59,45.09 148.59,29.84 142.88,24.13 v142.88,19.05
  Bottom 0.254: v149.22,45.72 E10.2 | v142.88,19.05 137.16,19.05 135.89,17.78 E18.6
KRS
  Top 0.254: E21.2 E21.7 87,20.32 | 87,20.32 E20.2 | E8.6 87,33.66 87,20.32 | E17.7 E4.2
  Bottom 0.254: E17.7 E17.2 137.16,20.32 135.89,19.05 124.46,19.05 | 111.76,19.05 110.49,20.32 E19.7 | 111.76,19.05 124.46,19.05 | 124.46,19.05 125.73,20.32 E18.2 | 111.76,19.05 91.44,19.05 90.17,20.32 E20.2
KSF  (via drill 0.61)
  Top 0.254: v99.69,40.64 99.69,22.23 100.97,20.95 E19.2
  Bottom 0.254: v99.69,40.64 98.42,41.91 91.44,41.91 90.17,43.18 E8.3
MR
  Bottom 0.254: E10.4 153.67,40.64 157.48,36.83 168.91,36.83 172.09,33.66 172.09,27.3 177.16,27.3 180.97,23.5 180.97,21.59 184.15,21.59 184.78,20.95 184.78,15.88 183.51,15.88 E5.21
N$1
  Bottom 0.254: E16.9 36.83,43.18 39.37,45.72 40.01,45.72 B.13
N$2
  Top 0.254: E9.1 217.17,40.64 216.53,40.64 PAD1.1
N$3
  Top 0.254: E9.2 217.17,38.1 216.53,38.1 PAD2.1
N$4
  Top 0.254: E9.3 217.17,35.56 216.53,35.56 PAD3.1
N$5
  Bottom 0.254: E16.15 36.83,58.42 39.37,60.96 40.01,60.96 B.1
N$6
  Bottom 0.254: E16.14 36.83,55.88 39.37,58.42 40.01,58.42 B.3
N$7
  Bottom 0.254: E16.13 36.83,53.34 39.37,55.88 40.01,55.88 B.5
N$8
  Bottom 0.254: E16.12 36.83,50.8 39.37,53.34 40.01,53.34 B.7
N$9
  Bottom 0.254: E16.11 36.83,48.26 39.37,50.8 40.01,50.8 B.9
N$10
  Bottom 0.254: E16.10 36.83,45.72 39.37,48.26 40.01,48.26 B.11
N$11
  Bottom 0.254: E16.7 29.21,45.72 33.02,41.91 38.73,41.91 40.01,43.18 B.15
N$12
  Top 0.254: E9.4 217.17,33.02 216.53,33.02 PAD4.1
N$13
  Top 0.254: X2.2 170.81,83.82 168.28,86.36 R1.2 167.64,87 167.64,88.27 C29.1
  Bottom 0.254: E3.11 184.15,78.74 180.34,82.55 173.35,82.55 172.09,83.82 X2.2
N$14
  Top 0.254: X2.1 170.81,78.74 168.28,76.2 R1.1 167.64,75.56 167.64,74.3 C28.1
  Bottom 0.254: E3.10 184.15,76.2 182.88,77.47 173.35,77.47 172.09,78.74 X2.1
N$15
  Bottom 0.508: C26.2 145.41,60.96 146.69,59.69 161.29,59.69 161.93,60.33 161.93,62.23 158.75,62.23 157.48,63.5 153.67,63.5 E12.6
N$16
  Bottom 0.508: C27.1 145.41,73.66 151.13,73.66 E12.2
N$17
  Top 0.254: R5.2 119.38,76.83 119.38,80.64 Q1.2
N$18
  Top 0.254: Q1.3 116.2,83.82 109.86,83.82 D1.A
  Bottom 0.254: R3.2 107.31,83.82 108.58,83.82 D1.A
N$19
  Top 0.254: R7.2 134.62,61.59 132.08,64.14 132.08,67.94 Q2.2
N$20
  Bottom 0.254: R8.2 120.02,71.12 121.28,71.12 D3.A 122.56,71.12 128.91,71.12 Q2.3
N$21
  Top 0.254: E9.5 217.17,30.48 216.53,30.48 PAD5.1
N$22
  Top 0.254: C24.2 147.32,62.87 150.5,59.69 150.5,57.78 151.13,57.15 154.31,57.15 154.31,64.14 153.03,65.41 E12.5
N$23
  Top 0.254: X1.1 212.72,78.74 215.26,76.2 R2.1 215.9,75.56 215.9,74.3 C30.1
  Bottom 0.254: E2.10 207.01,76.2 209.55,78.74 211.46,78.74 X1.1
N$24
  Top 0.254: R14.1 127,79.38 127,80.64 D6.C | D5.A 137.16,84.45 137.16,85.72 R13.2
  Bottom 0.254: D6.C 128.27,81.28 130.81,83.82 135.89,83.82 D5.A
N$25
  Top 0.254: X1.2 212.72,83.82 215.26,86.36 R2.2 215.9,87 215.9,88.27 C31.1
  Bottom 0.254: E2.11 206.38,79.38 210.82,83.82 211.46,83.82 X1.2
N$26
  Top 0.254: E8.11 97.16,41.27 98.42,42.55 98.42,69.22 97.16,70.48 E11.13
N$27
  Bottom 0.254: E6.12 138.43,43.18 147.32,34.29 157.48,34.29 158.75,33.02 E10.8
N$29  (via drill 0.61)
  Top 0.254: v138.43,63.5 150.5,51.44 150.5,45.09 151.13,44.45 150.5,43.81 150.5,37.47 151.76,36.2 E10.6
  Bottom 0.254: v138.43,63.5 100.33,63.5 97.79,66.04 E11.11
N$30
  Top 0.508: E10.10 159.38,38.73 158.12,40.01 158.12,43.81 159.38,45.09 E10.13
N$31
  Top 0.254: E9.6 217.17,27.94 216.53,27.94 PAD6.1
N$32
  Bottom 0.254: C25.2 147.96,71.12 151.13,71.12 E12.3
N$33
  Top 0.254: E9.7 217.17,25.4 216.53,25.4 PAD7.1
N$34
  Top 0.254: E22.1 217.17,66.04 216.53,66.04 PAD18.1
N$35
  Top 0.254: E9.8 217.17,22.86 216.53,22.86 PAD8.1
N$37
  Top 0.254: E9.16 227.33,40.64 227.97,40.64 PAD9.1
N$38
  Top 0.254: E9.15 227.33,38.1 227.97,38.1 PAD42.1
N$39
  Top 0.254: E9.14 227.33,35.56 227.97,35.56 PAD43.1
N$40
  Top 0.254: E9.13 227.33,33.02 227.97,33.02 PAD44.1
N$41
  Top 0.254: E22.2 217.17,63.5 216.53,63.5 PAD19.1
N$42
  Top 0.254: E9.12 227.33,30.48 227.97,30.48 PAD45.1
N$43
  Top 0.254: E22.3 217.17,60.96 216.53,60.96 PAD28.1
N$44
  Bottom 0.254: C24.1 147.96,68.58 151.13,68.58 E12.4
N$45
  Top 0.254: C25.1 147.96,76.2 151.13,76.2 E12.1
N$46
  Top 0.254: E9.11 227.33,27.94 227.97,27.94 PAD46.1
N$47
  Top 0.254: E9.10 227.33,25.4 227.97,25.4 PAD47.1
N$48
  Top 0.254: E9.9 227.33,22.86 227.97,22.86 PAD48.1
N$49
  Bottom 0.254: E14.15 36.83,30.48 39.37,33.02 40.01,33.02 T.1
N$50
  Top 0.254: E22.4 217.17,58.42 216.53,58.42 PAD29.1
N$51
  Top 0.254: E22.5 217.17,55.88 216.53,55.88 PAD30.1
N$52
  Top 0.254: E22.6 217.17,53.34 216.53,53.34 PAD31.1
N$53
  Top 0.254: E22.7 217.17,50.8 216.53,50.8 PAD32.1
N$54
  Top 0.254: E22.8 217.17,48.26 216.53,48.26 PAD33.1
N$55
  Top 0.254: E22.16 227.33,66.04 227.97,66.04 PAD34.1
N$56
  Top 0.254: E22.15 227.33,63.5 227.97,63.5 PAD35.1
N$57
  Top 0.254: E22.14 227.33,60.96 227.97,60.96 PAD36.1
N$58
  Top 0.254: E22.13 227.33,58.42 227.97,58.42 PAD37.1
N$59
  Top 0.254: E22.12 227.33,55.88 227.97,55.88 PAD38.1
N$60  (via drill 0.61)
  Top 0.508: E6.8 136.53,33.66 136.53,34.92 E6.9 | v154.94,33.02 v154.94,43.18
  Bottom 0.508: v154.94,43.18 158.75,43.18 E10.12 | v154.94,33.02 153.67,31.75 140.34,31.75 139.06,33.02 138.43,33.02 E6.8
N$61
  Top 0.254: E22.11 227.33,53.34 227.97,53.34 PAD39.1
N$68
  Top 0.254: E22.10 227.33,50.8 227.97,50.8 PAD40.1
N$69
  Top 0.254: E22.9 227.33,48.26 227.97,48.26 PAD41.1
N$90
  Bottom 0.254: E15.15 62.23,58.42 64.77,60.96 65.41,60.96 K.1
N$91
  Bottom 0.254: E15.14 62.23,55.88 64.77,58.42 65.41,58.42 K.3
N$97
  Bottom 0.254: E15.13 62.23,53.34 64.77,55.88 65.41,55.88 K.5
N$109
  Bottom 0.254: E15.12 62.23,50.8 64.77,53.34 65.41,53.34 K.7
N$112
  Bottom 0.254: E15.11 62.23,48.26 64.77,50.8 65.41,50.8 K.9
N$113
  Bottom 0.254: E15.10 62.23,45.72 64.77,48.26 65.41,48.26 K.11
N$114
  Bottom 0.254: E15.7 54.61,45.72 58.42,41.91 64.14,41.91 65.41,43.18 K.15
N$115
  Bottom 0.254: E15.9 62.23,43.18 64.77,45.72 65.41,45.72 K.13
N$116
  Bottom 0.254: E14.14 36.83,27.94 39.37,30.48 40.01,30.48 T.3
N$117
  Bottom 0.254: E14.13 36.83,25.4 39.37,27.94 40.01,27.94 T.5
N$118
  Bottom 0.254: E14.12 36.83,22.86 39.37,25.4 40.01,25.4 T.7
N$119
  Bottom 0.254: E14.11 36.83,20.32 39.37,22.86 40.01,22.86 T.9
N$120
  Bottom 0.254: E14.10 36.83,17.78 39.37,20.32 40.01,20.32 T.11
N$121
  Bottom 0.254: E14.7 29.21,17.78 33.02,13.97 38.73,13.97 40.01,15.24 T.15
N$122
  Bottom 0.254: E14.9 36.83,15.24 39.37,17.78 40.01,17.78 T.13
N$123
  Bottom 0.254: E13.15 62.23,30.48 64.77,33.02 65.41,33.02 P.1
N$124
  Bottom 0.254: E13.14 62.23,27.94 64.77,30.48 65.41,30.48 P.3
N$125
  Bottom 0.254: E13.13 62.23,25.4 64.77,27.94 65.41,27.94 P.5
N$126
  Bottom 0.254: E13.12 62.23,22.86 64.77,25.4 65.41,25.4 P.7
N$127
  Bottom 0.254: E13.11 62.23,20.32 64.77,22.86 65.41,22.86 P.9
N$128
  Bottom 0.254: E13.10 62.23,17.78 64.77,20.32 65.41,20.32 P.11
N$129
  Bottom 0.254: E13.7 54.61,17.78 58.42,13.97 64.14,13.97 65.41,15.24 P.15
N$130
  Bottom 0.254: E13.9 62.23,15.24 64.77,17.78 65.41,17.78 P.13
PT
  Bottom 0.254: E8.9 97.79,35.56 99.06,36.83 114.3,36.83 115.57,35.56 E7.9 117.47,36.2 123.19,41.91 | 123.19,41.91 127,41.91 128.27,40.64 E6.4 | 123.19,41.91 111.76,41.91 110.49,40.64 E7.4
RBR1  (via drill 0.61)
  Top 0.254: v158.75,28.57 v161.29,31.11
  Bottom 0.254: v158.75,28.57 88.9,28.57 88.9,23.5 E20.1 | v161.29,31.11 165.74,35.56 166.37,35.56 E5.12
RBR2  (via drill 0.61)
  Top 0.254: v92.71,25.4 92.71,13.97 87.63,13.97 84.45,17.14 E21.6 | v163.83,27.3 165.74,29.21 165.74,36.2 167,37.47 E5.11
  Bottom 0.254: v92.71,25.4 94.61,27.3 v163.83,27.3
RBR3  (via drill 0.61)
  Top 0.254: v163.83,8.89 169.54,14.61 169.54,38.73 168.28,40.01 E5.10
  Bottom 0.254: v163.83,8.89 156.84,8.89 155.57,7.62 99.06,7.62 97.79,8.89 74.3,8.89 74.3,20.95 75.56,22.23 E21.1
RBR4  (via drill 0.61)
  Top 0.254: v149.86,44.45 149.86,25.4 151.76,23.5 E4.1
  Bottom 0.254: v149.86,44.45 165.1,44.45 166.37,43.18 E5.9
RBR5
  Top 0.254: E17.6 148.59,17.78 150.5,17.78 150.5,18.41 151.13,19.05 158.12,19.05 158.12,13.34 163.83,7.62 170.18,7.62 170.18,43.18 168.28,45.09 E5.8
RBR6  (via drill 0.61)
  Top 0.254: v146.05,49.53 139.7,43.18 139.7,23.5 E17.1
  Bottom 0.254: v146.05,49.53 165.1,49.53 166.37,48.26 E5.7
RBR7  (via drill 0.61)
  Top 0.254: v127.64,49.53 127,48.9 127,23.5 E18.1
  Bottom 0.254: v127.64,49.53 144.78,49.53 146.69,51.44 152.4,51.44 153.03,52.07 165.1,52.07 166.37,50.8 E5.6
RBR8  (via drill 0.61)
  Top 0.254: v112.39,50.16 112.39,20.95 109.86,18.41 E19.6
  Bottom 0.254: v112.39,50.16 114.3,52.07 151.76,52.07 153.03,53.34 166.37,53.34 E5.5
RRUN
  Bottom 0.254: 123.83,62.23 124.46,61.59 R7.1 | 123.83,62.23 123.19,62.87 102.23,62.87 97.79,58.42 E11.8 | 123.83,62.23 157.48,62.23 158.75,60.96 E12.10
RRUN+
  Top 0.254: R10.2 127,56.52 127,57.78 D4.C | X3.6 114.3,99.69 120.65,93.34 120.65,63.5 121.92,62.23 D3.C
  Bottom 0.254: D3.C 122.56,60.33 124.46,58.42 125.73,58.42 D4.C
RRUN-
  Bottom 0.254: R9.2 116.84,71.75 105.41,83.19 105.41,99.69 104.14,99.69 X3.4
RTS
  Top 0.254: E12.8 151.76,59.05 151.76,60.33 E12.7 151.76,61.59 150.5,62.87 150.5,69.85 140.97,79.38 140.97,97.16 J1.8
RX  (via drill 0.61)
  Top 0.254: v147.32,41.91 v143.51,45.72 | v157.48,35.56 157.48,28.57 161.93,24.13 161.93,20.95 167,15.88 E5.20
  Bottom 0.254: v143.51,45.72 138.43,45.72 E6.13 | v147.32,41.91 151.13,38.1 E10.5 153.67,38.1 154.94,38.1 v157.48,35.56
RX+
  Bottom 0.254: 130.18,88.9 127.64,86.36 R13.1 | 130.18,88.9 136.53,88.9 R11.1 | 130.18,88.9 119.38,99.69 X3.7
RX-
  Top 0.254: R12.2 104.14,84.45 99.06,89.53 99.06,99.69 X3.3
RXD
  Top 0.254: E12.13 160.66,69.22 161.93,70.48 161.93,91.44 153.67,99.69 139.7,99.69 139.7,95.89 J1.3
RXE
  Top 0.254: E10.9 160.66,36.2 161.93,37.47 161.93,64.14 160.66,65.41 E12.12
STOPB
  Top 0.254: E5.36 184.15,53.34 188.59,53.34 188.59,51.44 189.23,50.8 STOPB.2
TBR1
  Bottom 0.254: E5.26 184.15,27.94 185.42,29.21 207.01,29.21 207.65,29.84 207.65,40.01 206.38,40.01 E1.18
TBR2
  Top 0.254: E5.27 182.25,31.11 180.97,32.38 180.97,43.81 181.61,44.45 207.65,44.45 207.65,37.47 206.38,36.2 E1.16
TBR3
  Bottom 0.254: E5.28 184.15,33.02 185.42,31.75 203.2,31.75 204.47,30.48 E1.14
TBR4
  Bottom 0.254: E5.29 184.15,35.56 184.78,36.2 196.22,36.2 196.85,36.83 199.39,36.83 204.47,41.91 207.01,41.91 208.28,40.64 208.28,26.04 206.38,26.04 E1.12
TBR5
  Bottom 0.254: E5.30 182.25,37.47 180.97,36.2 180.97,26.67 195.58,26.67 196.85,25.4 E1.9
TBR6  (via drill 0.61)
  Top 0.254: v191.77,38.73 196.22,34.29 196.22,32.38 197.49,31.11 E1.7
  Bottom 0.254: v191.77,38.73 186.06,38.73 184.15,40.64 E5.31
TBR7
  Top 0.254: E5.32 184.15,43.18 196.22,43.18 196.22,37.47 197.49,36.2 E1.5
TBR8
  Bottom 0.254: E5.33 184.15,45.72 189.23,40.64 196.85,40.64 E1.3
TPF
  Top 0.254: 99.06,15.24 100.33,13.97 107.31,13.97 107.31,15.88 107.95,16.51 112.39,16.51 112.39,18.41 113.67,19.68 E23.2 113.67,20.95 113.67,22.23 E23.1 | 99.06,15.24 97.16,17.14 E20.6 | 99.06,15.24 99.06,39.37 95.25,39.37 94.61,40.01 94.61,49.53 89.53,49.53 87,52.07 87,61.59 88.27,62.87 E11.5
TRE  (via drill 0.61)
  Top 0.254: v173.99,67.31 177.8,63.5 177.8,22.86 179.07,21.59 181.61,21.59 181.61,22.86 E5.24
  Bottom 0.254: v173.99,67.31 91.44,67.31 90.17,68.58 E11.3
TSF
  Top 0.254: E20.7 97.16,20.95 98.42,22.23 98.42,31.11 97.16,32.38 E8.8
TX  (via drill 0.61)
  Top 0.254: v135.89,66.04 135.89,69.22 129.54,75.56 R5.1 | v180.34,50.8 180.34,27.94 182.25,26.04 E5.25
  Bottom 0.254: v135.89,66.04 137.16,64.77 157.48,64.77 158.75,63.5 E12.11 161.29,63.5 161.93,63.5 163.19,62.23 168.91,62.23 v180.34,50.8
TX+
  Top 0.254: R6.2 114.3,69.22 114.3,70.48 D2.C | X3.5 109.22,99.69 107.95,98.42 107.95,76.2 109.22,74.93 D1.C
  Bottom 0.254: D1.C 109.86,73.03 111.76,71.12 113.03,71.12 D2.C
TX-
  Top 0.254: R4.2 101.6,84.45 94.61,91.44 94.61,99.69 X3.2
TXD
  Bottom 0.254: E12.14 161.29,71.12 162.56,72.39 173.35,72.39 173.99,73.03 173.99,76.83 168.91,76.83 152.4,93.34 138.43,93.34 137.16,94.61 J1.2
VCC
  Top 0.508: E14.16 34.92,33.66 34.92,34.29 34.29,34.92 C10.1 34.29,36.2 33.66,36.83 33.66,63.5 C12.1 34.29,62.87 34.92,62.23 34.92,61.59 E16.16 | C13.1 95.25,75.56 95.89,74.93 95.89,74.3 E11.14 | E8.14 95.89,48.9 95.25,49.53 95.25,50.16 C3.1 95.25,51.44 94.61,52.07 94.61,61.59 | 94.61,61.59 95.89,62.87 E11.10 | 94.61,61.59 94.61,66.67 95.89,67.94 E11.12 | E13.16 60.33,33.66 60.33,34.29 59.69,34.92 C9.1 59.69,36.2 59.05,36.83 59.05,40.01 | C22.1 68.58,90.81 75.56,97.79 C23.+ 77.47,99.69 85.72,107.95 85.72,108.58 111.12,108.58 116.2,103.5 116.2,100.33 127,89.53 R11.2 127,88.27 125.73,87 125.73,83.82 D5.C 126.36,83.19 125.09,81.92 125.09,71.12 129.54,66.67 Q2.1 129.54,65.41 133.35,61.59 133.35,53.98 135.89,51.44 C1.1 135.89,50.16 135.89,49.53 136.53,48.9 E6.14 136.53,47.62 133.35,44.45 133.35,26.04 C17.1 133.35,24.77 133.35,24.13 133.99,23.5 E18.8 | E15.16 60.33,61.59 60.33,62.23 59.69,62.87 C11.1 59.05,63.5 59.05,40.01 | C20.1 95.25,24.77 95.89,24.13 95.89,23.5 E20.8 | E4.8 159.38,23.5 158.75,24.13 158.75,24.77 C7.1 | E17.8 146.69,23.5 146.05,24.13 146.05,24.77 C16.1 | C2.1 115.57,50.16 115.57,49.53 116.2,48.9 E7.14 117.47,47.62 119.38,45.72 119.38,27.3 120.65,26.04 C18.1 120.65,24.77 120.65,24.13 121.28,23.5 E23.8 | E19.8 108.58,23.5 107.95,24.13 107.95,24.77 C19.1 | C6.1 184.15,93.34 184.78,92.71 184.78,92.08 E3.16 184.78,90.81 179.71,85.72 179.71,68.58 177.8,66.67 C8.1 | C5.1 204.47,93.34 205.1,92.71 205.1,92.08 E2.16 | E1.20 205.1,46.35 204.47,46.99 204.47,47.62 C4.1 | E5.34 182.25,48.9 182.25,50.16 E5.35 | E5.39 183.51,60.33 189.87,53.98 STOPB.3
  Top 0.508: E10.14 159.38,48.9 159.38,49.53 158.75,50.16 C15.1 158.75,51.44 158.12,52.07 158.12,67.31 | E12.16 159.38,76.83 158.75,77.47 158.75,78.11 C14.1 158.12,78.74 158.12,67.31 | 158.12,67.31 162.56,67.31 166.37,63.5 E5.1 | 59.05,40.01 83.19,40.01 83.19,23.5 E21.8
  Bottom 0.508: E14.6 28.57,20.95 33.66,26.04 33.66,33.02 34.29,33.02 E14.16 | E16.6 28.57,48.9 33.66,53.98 33.66,60.96 34.29,60.96 E16.16 36.83,60.96 40.64,64.77 41.91,64.77 | 91.44,72.39 92.71,73.66 95.25,73.66 E11.14 | 91.44,72.39 90.17,71.12 E11.2 | 91.44,72.39 95.25,68.58 E11.12 | E11.10 95.25,63.5 92.71,63.5 90.17,66.04 E11.4 87.63,66.04 85.09,63.5 60.33,63.5 C11.1 59.05,63.5 57.78,64.77 41.91,64.77 | E13.6 53.98,20.95 59.05,26.04 59.05,33.02 59.69,33.02 E13.16 | E15.6 53.98,48.9 59.05,53.98 59.05,60.96 59.69,60.96 E15.16 | E21.8 85.09,22.86 86.36,21.59 93.98,21.59 95.25,22.86 E20.8 97.79,22.86 99.06,24.13 111.76,24.13 | 111.76,24.13 110.49,22.86 E19.8 | 118.75,24.13 111.76,24.13 | 118.75,24.13 120.02,25.4 C18.1 | 131.44,24.13 132.72,25.4 C17.1 | 131.44,24.13 118.75,24.13 | 131.44,24.13 144.15,24.13 145.41,25.4 C16.1 | C7.1 158.12,25.4 156.84,26.67 152.4,26.67 148.59,22.86 E17.8 | C21.1 224.79,69.22 224.79,90.81 206.38,90.81 E2.16 | C6.1 184.78,93.98 186.06,95.25 202.56,95.25 203.84,93.98 C5.1 | 177.8,60.96 181.61,60.96 E5.39 184.15,60.96 186.69,60.96 189.23,63.5 5/8.3 | 177.8,60.96 171.45,60.96 168.91,63.5 E5.1 | 177.8,60.96 177.8,65.41 C8.1 | E5.35 184.15,50.8 186.69,50.8 189.23,53.34 STOPB.3 191.77,53.34 198.75,53.34 203.84,48.26 C4.1 | 124.46,82.55 116.84,82.55 116.84,79.38 Q1.1 | 124.46,82.55 125.73,83.82 D5.C | 146.69,80.01 145.41,78.74 C27.2 | 146.69,80.01 156.84,80.01 158.12,78.74 C14.1 | 124.46,82.55 124.46,80.01 146.69,80.01 | 41.91,64.77 41.91,75.56 IC2.3

## Text on the board
Bottom: Posibus Serial Interface | VRS
tPlace: Posibus Serial Interface | VRS